# EAGLE design power_backup (EAGLE 5.11)
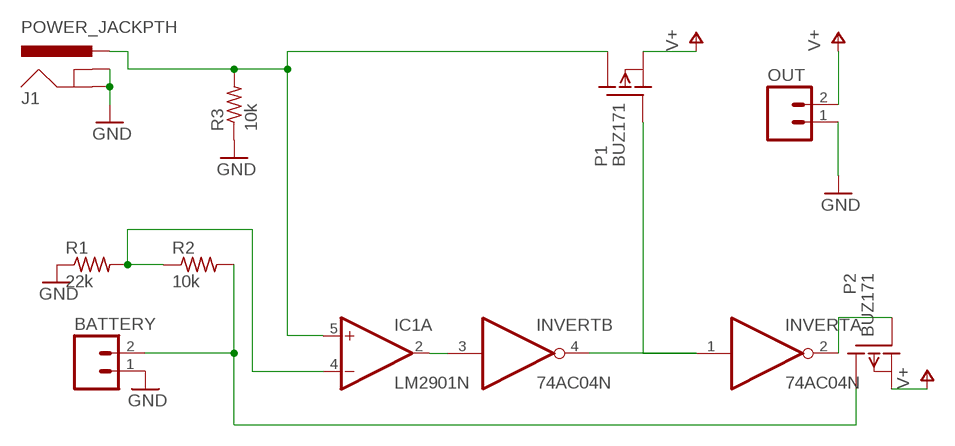
[diagram p0: schematic, sheet 1]

## Parts
BATTERY  M025MM  [SCREWTERMINAL-5MM-2]
IC1  LM2901N  [DIL14]
INVERT  74AC04N  [DIL14]
J1  POWER_JACKPTH  [POWER_JACK_PTH]
OUT  M025MM  [SCREWTERMINAL-5MM-2]
P1  BUZ171  [TO220]
P2  BUZ171  [TO220]
R1  22k  R-US_0309/12  [0309/12]
R2  10k  R-US_0309/12  [0309/12]
R3  10k  R-US_0309/12  [0309/12]

## Nets
GND: BATTERY.1 J1.GND J1.GNDBREAK OUT.1 R1.1 R3.1
N$1: IC1.2(A:OUT) INVERT.3(B:I)
N$2: INVERT.1(A:I) INVERT.4(B:O) P1.1(G)
N$3: INVERT.2(A:O) P2.1(G)
N$4: BATTERY.2 P2.2(D) R2.2
N$5: IC1.5(A:+IN) J1.PWR P1.2(D) R3.2
N$6: IC1.4(A:-IN) R1.2 R2.1
V+: OUT.2 P1.3(S) P2.3(S)
Unconnected: IC1.1(B:OUT) IC1.6(B:-IN) IC1.7(B:+IN) IC1.8(C:-IN) IC1.9(C:+IN) IC1.10(D:-IN) IC1.11(D:+IN) IC1.13(D:OUT) IC1.14(C:OUT) INVERT.5(C:I) INVERT.6(C:O) INVERT.8(D:O) INVERT.9(D:I) INVERT.10(E:O) INVERT.11(E:I) INVERT.12(F:O) INVERT.13(F:I)

## Power pins joined to a net without a drawn wire
GND: INVERT.7(P:GND)
V+: IC1.3(P:V+)
V-: IC1.12(P:V-)
VCC: INVERT.14(P:VCC)

## Library data of the parts
BATTERY OUT = SparkFun:M02: Header 2 Standard 2-pin 0.1" header. Use with straight break away headers (SKU : PRT-00116), right angle break away headers (PRT-00553), swiss pins (PRT-00743), machine pins (PRT-00117), and female headers (PRT-00115). Molex polarized connector foot print use with SKU : PRT-08233 with associated crimp pins and housings.
IC1 = linear:LM2901: COMPARATOR
INVERT = 74xx-eu:74*04: Hex INVERTER
J1 = SparkFun:POWER_JACK: Power Jack This is the standard 5.5mm barrel jack for power. The PTH is the most common, proven, reliable, footprint. All others are experimental. The Slot footprint only works if the mill layer is transmitted to the PCB fab house so be warned. Spark Fun Electronics SKU : PRT-00119. Mating wall wart : TOL-00298 (and others)
P1 P2 = transistor-fet:BUZ171: P-Channel Enhancement MOSFET -50V; 7A; 0,4Ohm
R1-R3 = rcl:R-US_: RESISTOR, American symbol

## Board
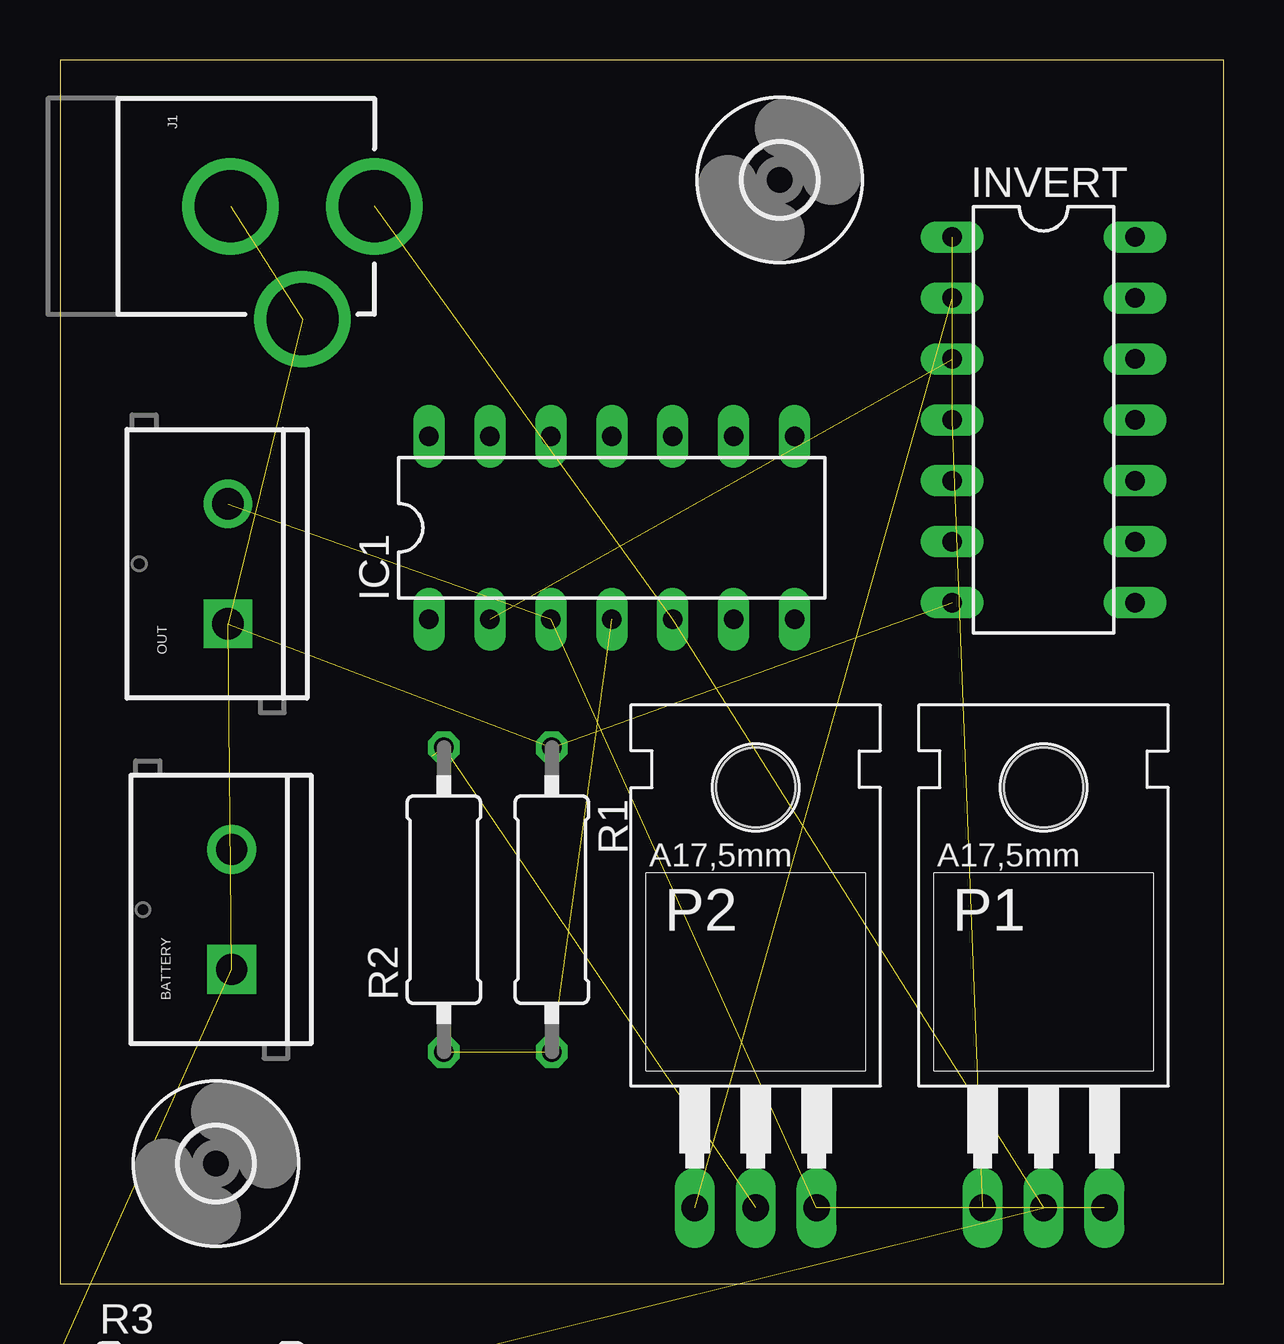
[diagram p1: board, top side]
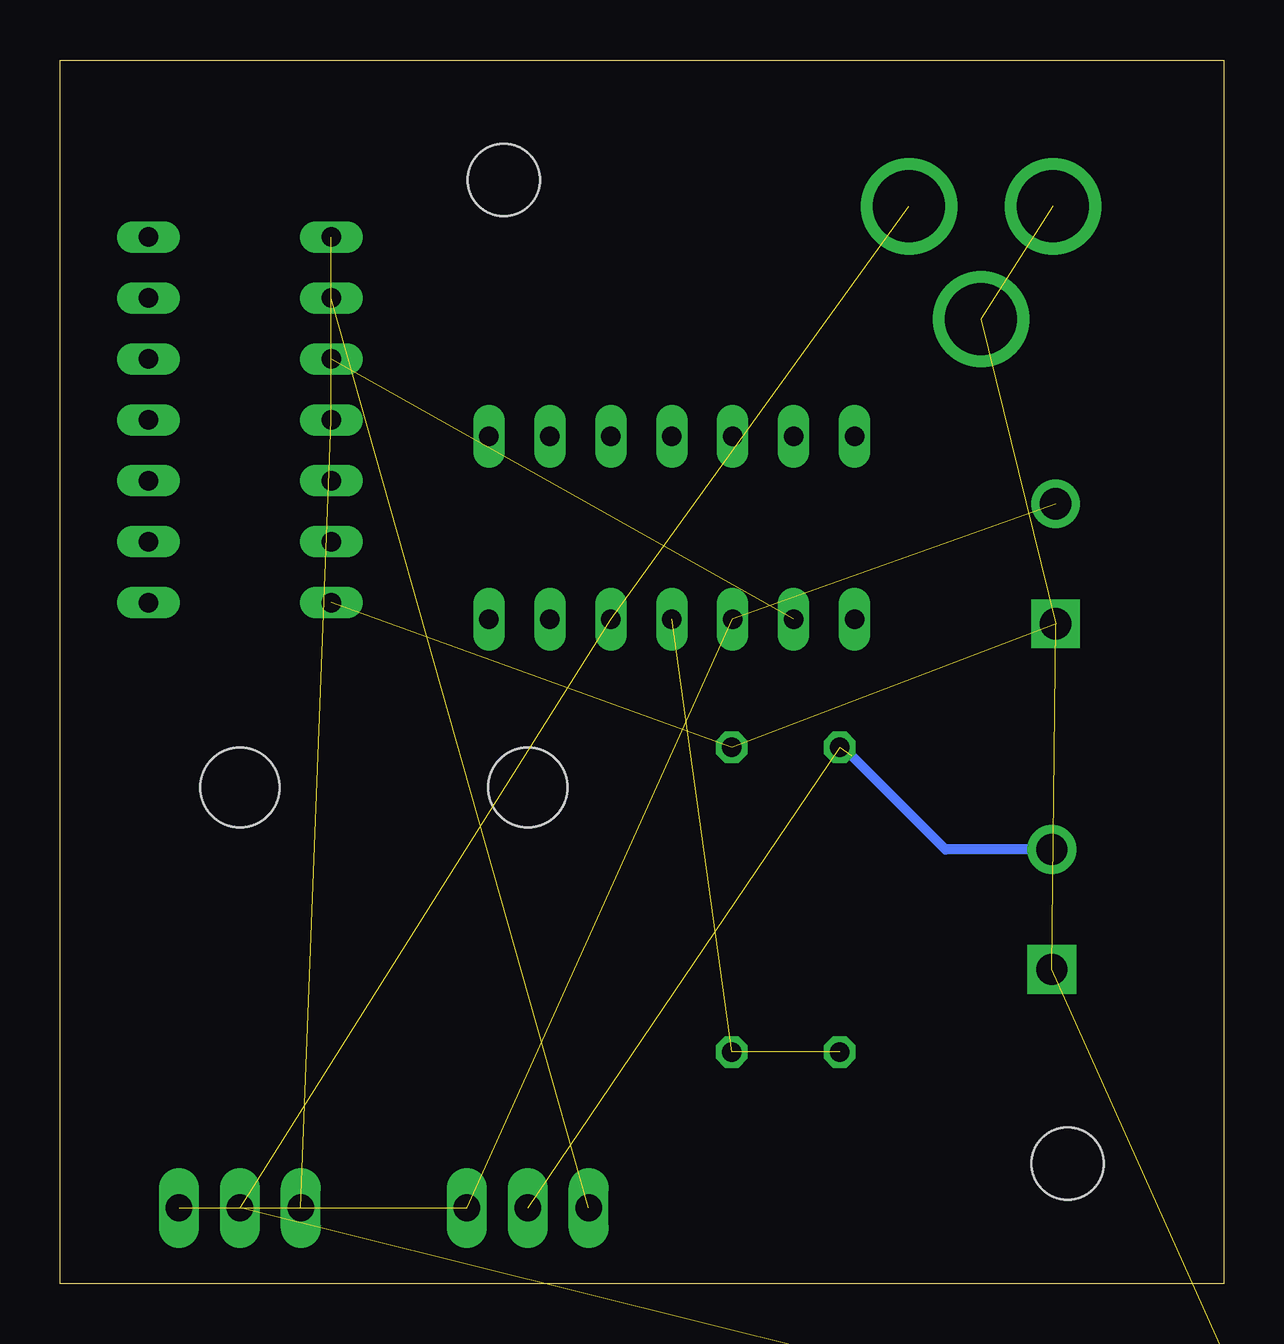
[diagram p2: board, bottom side, seen from below]

Size 48.5 x 51 mm. Coordinates in mm from the lower left corner, seen from the top.
Outline: 0,0 48.5,0 48.5,51 0,51 0,0
Copper layers (1*16): Top 0.035mm / dielectric 1.5mm / Bottom 0.035mm
Design rules "default": minimum track width 10mil, minimum drill 24mil, track to track 8mil, track to pad 8mil, pad to pad 8mil, via to via 8mil, smd to smd 8mil, copper to edge 40mil, drill to drill 8mil, minimum pad ring 10mil, minimum via ring 8mil, stop-mask expansion 4mil, vias tented up to drill 0mil, thermal gap 10mil

### Footprints (pad centres in the part's own frame; a part is rotated, then mirrored left to right if it is on the bottom)
SCREWTERMINAL-5MM-2 = drill 1.3 pad 2.032 square: 1 0,0 | drill 1.3 pad 2.032 round: 2 5,0
DIL14 = drill 0.813 long: 1 -7.62,-3.81; 2 -5.08,-3.81; 3 -2.54,-3.81; 4 0,-3.81; 5 2.54,-3.81; 6 5.08,-3.81; 7 7.62,-3.81; 8 7.62,3.81; 9 5.08,3.81; 10 2.54,3.81; 11 0,3.81; 12 -2.54,3.81; 13 -5.08,3.81; 14 -7.62,3.81
POWER_JACK_PTH = drill 2.997 round: GND 0,7.7; GNDBREAK 4.7,10.7; PWR 0,13.7
TO220 = drill 1.118 long: 1 -2.54,-6.35; 2 0,-6.35; 3 2.54,-6.35 | hole 3.302: 0,11.176
0309/12 = drill 0.813 octagon: 1 -6.35,0; 2 6.35,0
3,0 = hole 3: 0,0

### Placement (x,y rotation side)
BATTERY  7.16,13.09 90 top
IC1  23,31.5 0 top
INVERT  41,36 270 top
J1  -0.59,44.9 270 top
OUT  7,27.5 90 top
P1  41,9.5 0 top
P2  29,9.5 0 top
R1  20.5,16 270 top
R2  16,16 90 top
R3  5.84,-4 0 top  (outside the outline)
U$1  [3,0]  6.5,5 0 top
U$2  [3,0]  30,46 0 top

### Tracks (layer width: path | path; a pad name or v marks a point on that pad's centre or on a via)
GND  (6 unrouted)
N$1  (1 unrouted)
N$2  (2 unrouted)
N$3  (1 unrouted)
N$4  (2 unrouted)
  Bottom 0.406: BATTERY.2 11.59,18.09 15.5,22
N$5  (3 unrouted)
N$6  (2 unrouted)
V+  (3 unrouted)